# EAGLE schematic PARAMETRIK_crosover (EAGLE 6.6.0)
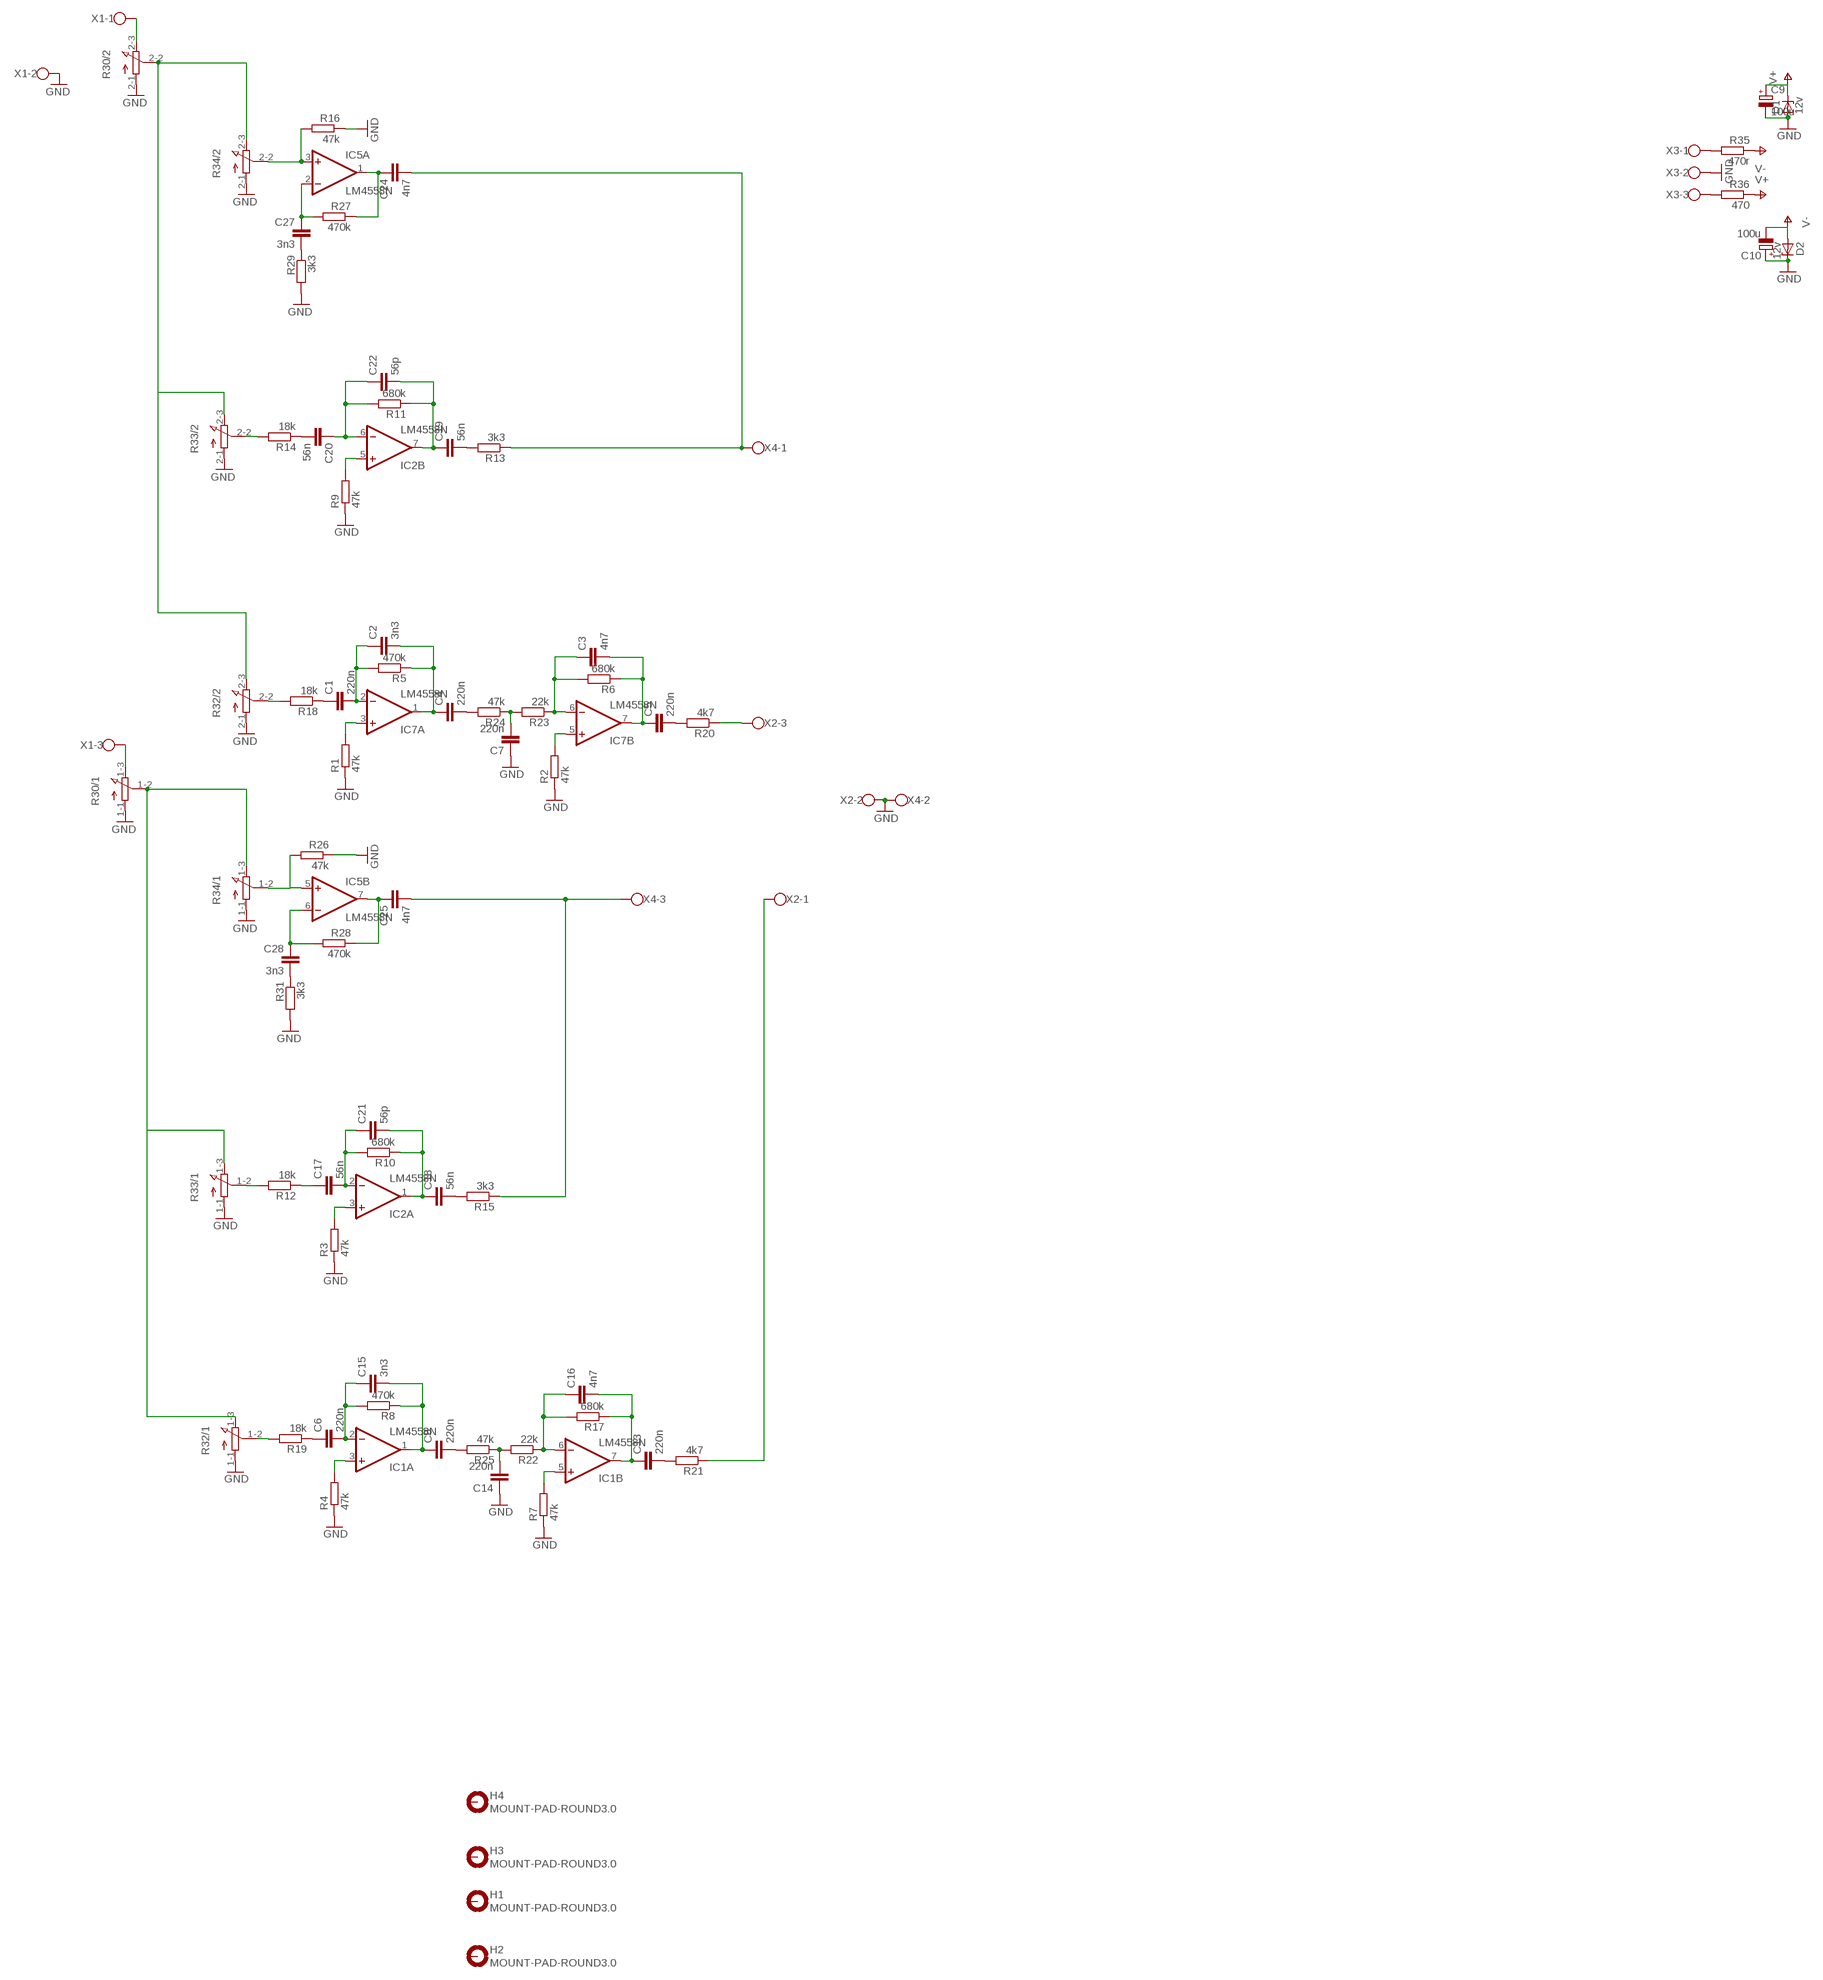
[diagram p0: schematic, sheet 1]

## Parts
C1  220n  C-EU075-032X103  [C075-032X103]
C2  3n3  C-EU025-025X050  [C025-025X050]
C3  4n7  C-EU025-025X050  [C025-025X050]
C4  220n  C-EU075-032X103  [C075-032X103]
C5  220n  C-EU075-032X103  [C075-032X103]
C6  220n  C-EU075-032X103  [C075-032X103]
C7  220n  C-EU075-032X103  [C075-032X103]
C8  220n  C-EU075-032X103  [C075-032X103]
C9  100u  CPOL-EUE2.5-6  [E2,5-6]
C10  100u  CPOL-EUE2.5-6  [E2,5-6]
C13  220n  C-EU075-032X103  [C075-032X103]
C14  220n  C-EU075-032X103  [C075-032X103]
C15  3n3  C-EU025-025X050  [C025-025X050]
C16  4n7  C-EU025-025X050  [C025-025X050]
C17  56n  C-EU075-032X103  [C075-032X103]
C18  56n  C-EU075-032X103  [C075-032X103]
C19  56n  C-EU075-032X103  [C075-032X103]
C20  56n  C-EU075-032X103  [C075-032X103]
C21  56p  C-EU025-025X050  [C025-025X050]
C22  56p  C-EU025-025X050  [C025-025X050]
C24  4n7  C-EU075-032X103  [C075-032X103]
C25  4n7  C-EU075-032X103  [C075-032X103]
C27  3n3  C-EU025-025X050  [C025-025X050]
C28  3n3  C-EU025-025X050  [C025-025X050]
D1  12v  1N821  [DO35Z10]
D2  12v  1N821  [DO35Z10]
H1  MOUNT-PAD-ROUND3.0  [3,0-PAD]
H2  MOUNT-PAD-ROUND3.0  [3,0-PAD]
H3  MOUNT-PAD-ROUND3.0  [3,0-PAD]
H4  MOUNT-PAD-ROUND3.0  [3,0-PAD]
IC1  LM4558N  [DIL08]
IC2  LM4558N  [DIL08]
IC5  LM4558N  [DIL08]
IC7  LM4558N  [DIL08]
R1  47k  R-EU_0207/10  [0207/10]
R2  47k  R-EU_0207/10  [0207/10]
R3  47k  R-EU_0207/10  [0207/10]
R4  47k  R-EU_0207/10  [0207/10]
R5  470k  R-EU_0207/10  [0207/10]
R6  680k  R-EU_0207/10  [0207/10]
R7  47k  R-EU_0207/10  [0207/10]
R8  470k  R-EU_0207/10  [0207/10]
R9  47k  R-EU_0207/10  [0207/10]
R10  680k  R-EU_0207/10  [0207/10]
R11  680k  R-EU_0207/10  [0207/10]
R12  18k  R-EU_0207/10  [0207/10]
R13  3k3  R-EU_0207/10  [0207/10]
R14  18k  R-EU_0207/10  [0207/10]
R15  3k3  R-EU_0207/10  [0207/10]
R16  47k  R-EU_0207/10  [0207/10]
R17  680k  R-EU_0207/10  [0207/10]
R18  18k  R-EU_0207/10  [0207/10]
R19  18k  R-EU_0207/10  [0207/10]
R20  4k7  R-EU_0207/10  [0207/10]
R21  4k7  R-EU_0207/10  [0207/10]
R22  22k  R-EU_0207/10  [0207/10]
R23  22k  R-EU_0207/10  [0207/10]
R24  47k  R-EU_0207/10  [0207/10]
R25  47k  R-EU_0207/10  [0207/10]
R26  47k  R-EU_0207/10  [0207/10]
R27  470k  R-EU_0207/10  [0207/10]
R28  470k  R-EU_0207/10  [0207/10]
R29  3k3  R-EU_0207/10  [0207/10]
R30  3RP/1610G  [3RP/1610G]
R31  3k3  R-EU_0207/10  [0207/10]
R32  3RP/1610G  [3RP/1610G]
R33  3RP/1610G  [3RP/1610G]
R34  3RP/1610G  [3RP/1610G]
R35  470r  R-EU_0207/10  [0207/10]
R36  470  R-EU_0207/10  [0207/10]
X1  W237-103  [W237-103]
X2  W237-103  [W237-103]
X3  W237-103  [W237-103]
X4  W237-103  [W237-103]

## Nets
GND: C7.1 C9.- C10.+ C14.1 D1.A D2.C R1.1 R2.1 R3.1 R4.1 R7.1 R9.1 R16.1 R26.1 R29.2 R30.1-1(/1:A) R30.2-1(/2:A) R31.2 R32.1-1(/1:A) R32.2-1(/2:A) R33.1-1(/1:A) R33.2-1(/2:A) R34.1-1(/1:A) R34.2-1(/2:A) X1.2 X2.2 X3.2 X4.2
N$1: IC1.3(A:+IN) R4.2
N$2: IC1.5(B:+IN) R7.2
N$3: IC7.3(A:+IN) R1.2
N$4: IC7.5(B:+IN) R2.2
N$5: C1.2 C2.1 IC7.2(A:-IN) R5.2
N$6: C6.2 C15.1 IC1.2(A:-IN) R8.2
N$7: C8.1 C15.2 IC1.1(A:OUT) R8.1
N$8: C16.1 IC1.6(B:-IN) R17.2 R22.1
N$9: C13.1 C16.2 IC1.7(B:OUT) R17.1
N$10: C2.2 C4.1 IC7.1(A:OUT) R5.1
N$11: C3.1 IC7.6(B:-IN) R6.2 R23.1
N$12: C3.2 C5.1 IC7.7(B:OUT) R6.1
N$13: IC2.3(A:+IN) R3.2
N$14: IC2.5(B:+IN) R9.2
N$15: C17.2 C21.1 IC2.2(A:-IN) R10.2
N$16: C18.1 C21.2 IC2.1(A:OUT) R10.1
N$17: C20.1 C22.1 IC2.6(B:-IN) R11.2
N$18: C19.1 C22.2 IC2.7(B:OUT) R11.1
N$19: C17.1 R12.1
N$20: C19.2 R13.2
N$21: C18.2 R15.2
N$22: C28.2 R31.1
N$23: C20.2 R14.1
N$24: R12.2 R33.1-2(/1:S)
N$25: C6.1 R19.1
N$26: C1.1 R18.1
N$27: C13.2 R21.2
N$28: C5.2 R20.2
N$29: C24.2 R13.1 X4.1
N$30: IC5.3(A:+IN) R16.2 R34.2-2(/2:S)
N$31: C8.2 R25.2
N$32: C14.2 R22.2 R25.1
N$33: C4.2 R24.2
N$34: C7.2 R23.2 R24.1
N$35: IC5.5(B:+IN) R26.2 R34.1-2(/1:S)
N$36: C27.1 IC5.2(A:-IN) R27.2
N$37: C24.1 IC5.1(A:OUT) R27.1
N$38: C28.1 IC5.6(B:-IN) R28.2
N$39: C25.1 IC5.7(B:OUT) R28.1
N$40: C27.2 R29.1
N$41: R21.1 X2.1
N$42: R14.2 R33.2-2(/2:S)
N$43: R19.2 R32.1-2(/1:S)
N$44: R18.2 R32.2-2(/2:S)
N$45: R30.2-2(/2:S) R32.2-3(/2:E) R33.2-3(/2:E) R34.2-3(/2:E)
N$46: R35.2 X3.1
N$47: R30.1-2(/1:S) R32.1-3(/1:E) R33.1-3(/1:E) R34.1-3(/1:E)
N$48: R36.2 X3.3
N$49: R30.2-3(/2:E) X1.1
N$50: R30.1-3(/1:E) X1.3
N$51: C25.2 R15.1 X4.3
N$52: R20.1 X2.3
V+: C9.+ D1.C R36.1
V-: C10.- D2.A R35.1
Unconnected: H1.B3,0(MOUNT) H2.B3,0(MOUNT) H3.B3,0(MOUNT) H4.B3,0(MOUNT)

## Power pins joined to a net without a drawn wire
V+: IC1.8(P:V+) IC2.8(P:V+) IC5.8(P:V+) IC7.8(P:V+)
V-: IC1.4(P:V-) IC2.4(P:V-) IC5.4(P:V-) IC7.4(P:V-)

## Library data of the parts
C1-C8 C13-C22 C24 C25 C27 C28 = resistor:C-EU: CAPACITOR, European symbol
C9 C10 = resistor:CPOL-EU: POLARIZED CAPACITOR, European symbol
D1 D2 = diode:1N821: Reference DIODE temperature compensated, 6,2 V
H1-H4 = holes:MOUNT-PAD-ROUND: MOUNTING PAD, round
IC1 IC2 IC5 IC7 = linear:*4558: OP AMP
R1-R29 R31 R35 R36 = resistor:R-EU_: RESISTOR, European symbol
R30 R32-R34 = pot:3RP/1610G: 16mm Potentiometer two level Source: http://www.alphapotentiometers.net/html/16mm_pot_2.html
X1-X4 = con-wago-500:W237-103: WAGO SCREW CLAMP; MPN: 237-103; OC_FARNELL: unknown; OC_NEWARK: 18M7116